# EAGLE schematic LED strip (EAGLE 6.4)
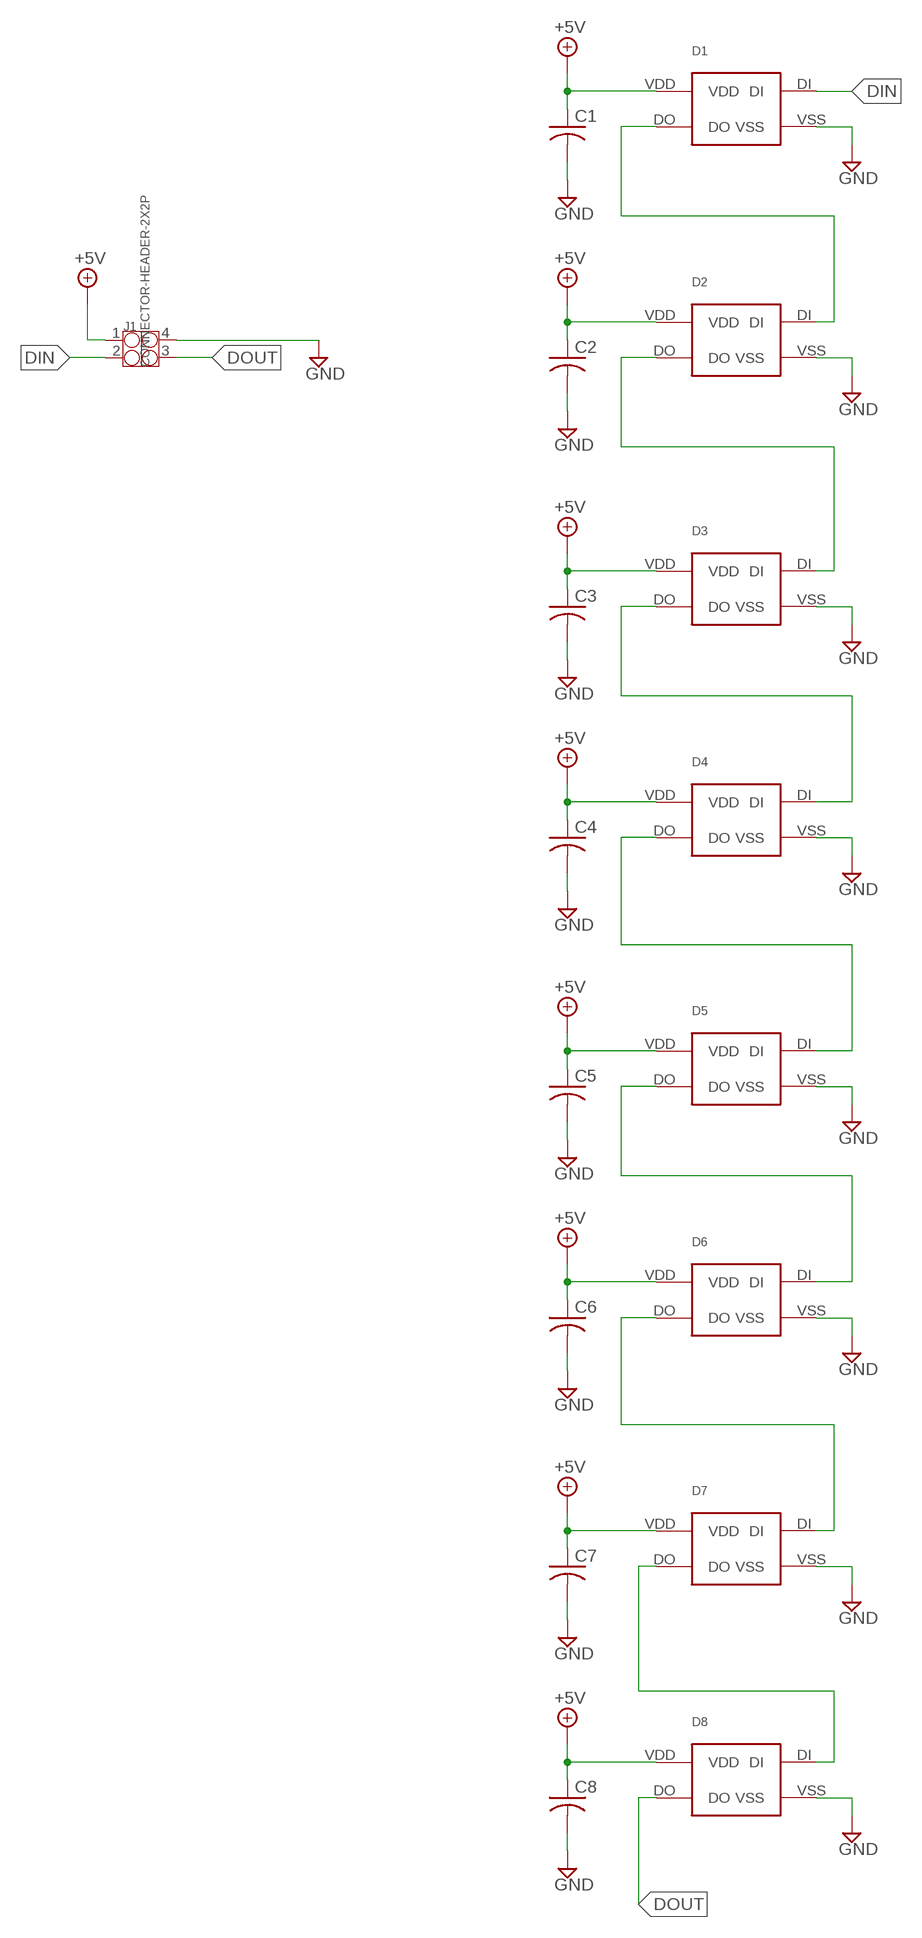
[diagram p0: schematic, sheet 1]

## Parts
C1  C-USC0603K  [C0603K]
C2  C-USC0603K  [C0603K]
C3  C-USC0603K  [C0603K]
C4  C-USC0603K  [C0603K]
C5  C-USC0603K  [C0603K]
C6  C-USC0603K  [C0603K]
C7  C-USC0603K  [C0603K]
C8  C-USC0603K  [C0603K]
D1  WS2812B  [WS2812B]
D2  WS2812B  [WS2812B]
D3  WS2812B  [WS2812B]
D4  WS2812B  [WS2812B]
D5  WS2812B  [WS2812B]
D6  WS2812B  [WS2812B]
D7  WS2812B  [WS2812B]
D8  WS2812B  [WS2812B]
J1  CONNECTOR-HEADER-2X2P  [2X2P-2.54]

## Nets
+5V: C1.1 C2.1 C3.1 C4.1 C5.1 C6.1 C7.1 C8.1 D1.VDD D2.VDD D3.VDD D4.VDD D5.VDD D6.VDD D7.VDD D8.VDD J1.1
DIN: D1.DI J1.2
DOUT: D8.DO J1.3
GND: C1.2 C2.2 C3.2 C4.2 C5.2 C6.2 C7.2 C8.2 D1.VSS D2.VSS D3.VSS D4.VSS D5.VSS D6.VSS D7.VSS D8.VSS J1.4
N$1: D1.DO D2.DI
N$2: D2.DO D3.DI
N$3: D3.DO D4.DI
N$4: D4.DO D5.DI
N$5: D5.DO D6.DI
N$6: D6.DO D7.DI
N$7: D7.DO D8.DI

## Library data of the parts
C1-C8 = resistor:C-US: CAPACITOR, American symbol
D1-D8 = lumex:WS2812B
J1 = OPL Eagle Library:CONNECTOR-HEADER-2X2P